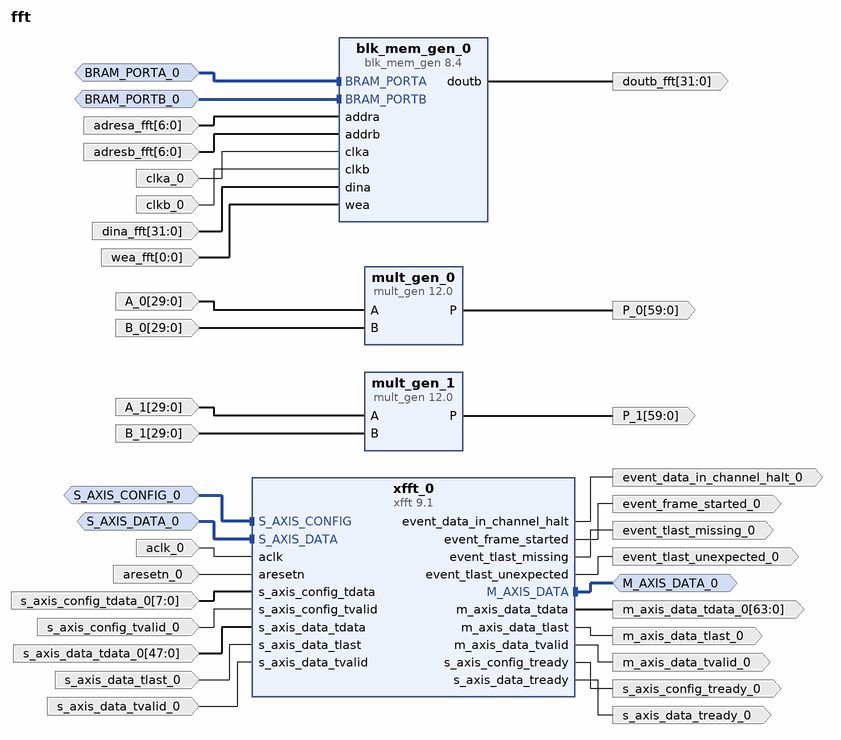
[diagram p0: block diagram of the top level]
# Vivado block design fft, xc7a35tcpg236-1, Vivado 2022.1
create_bd_design fft

create_bd_intf_port -mode Slave -vlnv xilinx.com:interface:axis_rtl:1.0 S_AXIS_DATA_0
set_property -dict [list \
  CONFIG.FREQ_HZ 40000000 \
  CONFIG.HAS_TKEEP 0 \
  CONFIG.HAS_TLAST 1 \
  CONFIG.HAS_TREADY 1 \
  CONFIG.HAS_TSTRB 0 \
  CONFIG.LAYERED_METADATA undef \
  CONFIG.TDATA_NUM_BYTES 6 \
  CONFIG.TDEST_WIDTH 0 \
  CONFIG.TID_WIDTH 0 \
  CONFIG.TUSER_WIDTH 0 \
] [get_bd_intf_ports S_AXIS_DATA_0]
create_bd_intf_port -mode Master -vlnv xilinx.com:interface:axis_rtl:1.0 M_AXIS_DATA_0
set_property -dict {CONFIG.FREQ_HZ 40000000} [get_bd_intf_ports M_AXIS_DATA_0]
create_bd_intf_port -mode Slave -vlnv xilinx.com:interface:axis_rtl:1.0 S_AXIS_CONFIG_0
set_property -dict [list \
  CONFIG.FREQ_HZ 40000000 \
  CONFIG.HAS_TKEEP 0 \
  CONFIG.HAS_TLAST 0 \
  CONFIG.HAS_TREADY 1 \
  CONFIG.HAS_TSTRB 0 \
  CONFIG.LAYERED_METADATA undef \
  CONFIG.TDATA_NUM_BYTES 1 \
  CONFIG.TDEST_WIDTH 0 \
  CONFIG.TID_WIDTH 0 \
  CONFIG.TUSER_WIDTH 0 \
] [get_bd_intf_ports S_AXIS_CONFIG_0]
create_bd_intf_port -mode Slave -vlnv xilinx.com:interface:bram_rtl:1.0 BRAM_PORTA_0
create_bd_intf_port -mode Slave -vlnv xilinx.com:interface:bram_rtl:1.0 BRAM_PORTB_0
create_bd_port -dir I -type clk aclk_0
set_property -dict {CONFIG.FREQ_HZ 40000000} [get_bd_ports aclk_0]
create_bd_port -dir I -type rst aresetn_0
create_bd_port -dir O -type intr event_data_in_channel_halt_0
create_bd_port -dir O -type intr event_frame_started_0
create_bd_port -dir O -type intr event_tlast_missing_0
create_bd_port -dir O -type intr event_tlast_unexpected_0
create_bd_port -dir O -from 63 -to 0 m_axis_data_tdata_0
create_bd_port -dir O m_axis_data_tlast_0
create_bd_port -dir O m_axis_data_tvalid_0
create_bd_port -dir I -from 47 -to 0 s_axis_data_tdata_0
create_bd_port -dir I s_axis_data_tlast_0
create_bd_port -dir O s_axis_data_tready_0
create_bd_port -dir I s_axis_data_tvalid_0
create_bd_port -dir I -from 7 -to 0 s_axis_config_tdata_0
create_bd_port -dir O s_axis_config_tready_0
create_bd_port -dir I s_axis_config_tvalid_0
create_bd_port -dir I -from 29 -to 0 -type data A_0
create_bd_port -dir I -from 29 -to 0 -type data B_0
create_bd_port -dir O -from 59 -to 0 -type data P_0
create_bd_port -dir I -from 29 -to 0 -type data A_1
create_bd_port -dir I -from 29 -to 0 -type data B_1
create_bd_port -dir O -from 59 -to 0 -type data P_1
create_bd_port -dir I -type clk clka_0
create_bd_port -dir I -from 31 -to 0 dina_fft
create_bd_port -dir I -from 0 -to 0 wea_fft
create_bd_port -dir I -type clk clkb_0
create_bd_port -dir O -from 31 -to 0 doutb_fft
create_bd_port -dir I -from 6 -to 0 adresa_fft
create_bd_port -dir I -from 6 -to 0 adresb_fft

create_bd_cell -type ip -vlnv xilinx.com:ip:xfft:9.1 xfft_0
set_property -dict [list \
  CONFIG.aresetn true \
  CONFIG.implementation_options radix_2_lite_burst_io \
  CONFIG.input_width 20 \
  CONFIG.number_of_stages_using_block_ram_for_data_and_phase_factors 0 \
  CONFIG.output_ordering natural_order \
  CONFIG.scaling_options unscaled \
  CONFIG.target_clock_frequency 100 \
  CONFIG.throttle_scheme realtime \
  CONFIG.transform_length 512 \
] [get_bd_cells xfft_0]
create_bd_cell -type ip -vlnv xilinx.com:ip:mult_gen:12.0 mult_gen_0
set_property -dict [list \
  CONFIG.Multiplier_Construction Use_Mults \
  CONFIG.PipeStages 0 \
  CONFIG.PortAType Signed \
  CONFIG.PortAWidth 30 \
  CONFIG.PortBWidth 30 \
] [get_bd_cells mult_gen_0]
create_bd_cell -type ip -vlnv xilinx.com:ip:mult_gen:12.0 mult_gen_1
set_property -dict [list \
  CONFIG.Multiplier_Construction Use_Mults \
  CONFIG.PipeStages 0 \
  CONFIG.PortAWidth 30 \
  CONFIG.PortBWidth 30 \
] [get_bd_cells mult_gen_1]
create_bd_cell -type ip -vlnv xilinx.com:ip:blk_mem_gen:8.4 blk_mem_gen_0
set_property -dict [list \
  CONFIG.Enable_32bit_Address false \
  CONFIG.Enable_A Always_Enabled \
  CONFIG.Enable_B Always_Enabled \
  CONFIG.Memory_Type Simple_Dual_Port_RAM \
  CONFIG.Operating_Mode_A NO_CHANGE \
  CONFIG.Port_B_Clock 100 \
  CONFIG.Port_B_Enable_Rate 100 \
  CONFIG.Register_PortB_Output_of_Memory_Primitives true \
  CONFIG.Use_Byte_Write_Enable false \
  CONFIG.Write_Depth_A 128 \
  CONFIG.use_bram_block Stand_Alone \
] [get_bd_cells blk_mem_gen_0]

# ---- connections ----

connect_bd_intf_net -intf_net BRAM_PORTA_0_1 [get_bd_intf_ports BRAM_PORTA_0] [get_bd_intf_pins blk_mem_gen_0/BRAM_PORTA]
connect_bd_intf_net -intf_net BRAM_PORTB_0_1 [get_bd_intf_ports BRAM_PORTB_0] [get_bd_intf_pins blk_mem_gen_0/BRAM_PORTB]
connect_bd_intf_net -intf_net S_AXIS_CONFIG_0_1 [get_bd_intf_ports S_AXIS_CONFIG_0] [get_bd_intf_pins xfft_0/S_AXIS_CONFIG]
connect_bd_intf_net -intf_net S_AXIS_DATA_0_1 [get_bd_intf_ports S_AXIS_DATA_0] [get_bd_intf_pins xfft_0/S_AXIS_DATA]
connect_bd_intf_net [get_bd_intf_ports M_AXIS_DATA_0] [get_bd_intf_pins xfft_0/M_AXIS_DATA]
connect_bd_net -net A_0_1 [get_bd_ports A_0] [get_bd_pins mult_gen_0/A]
connect_bd_net -net A_1_1 [get_bd_ports A_1] [get_bd_pins mult_gen_1/A]
connect_bd_net -net B_0_1 [get_bd_ports B_0] [get_bd_pins mult_gen_0/B]
connect_bd_net -net B_1_1 [get_bd_ports B_1] [get_bd_pins mult_gen_1/B]
connect_bd_net -net aclk_0_1 [get_bd_ports aclk_0] [get_bd_pins xfft_0/aclk]
connect_bd_net -net addra_0_1 [get_bd_ports adresa_fft] [get_bd_pins blk_mem_gen_0/addra]
connect_bd_net -net addrb_0_1 [get_bd_ports adresb_fft] [get_bd_pins blk_mem_gen_0/addrb]
connect_bd_net -net aresetn_0_1 [get_bd_ports aresetn_0] [get_bd_pins xfft_0/aresetn]
connect_bd_net [get_bd_pins blk_mem_gen_0/doutb] [get_bd_ports doutb_fft]
connect_bd_net -net clka_0_1 [get_bd_ports clka_0] [get_bd_pins blk_mem_gen_0/clka]
connect_bd_net -net clkb_0_1 [get_bd_ports clkb_0] [get_bd_pins blk_mem_gen_0/clkb]
connect_bd_net [get_bd_ports dina_fft] [get_bd_pins blk_mem_gen_0/dina]
connect_bd_net [get_bd_pins mult_gen_0/P] [get_bd_ports P_0]
connect_bd_net [get_bd_pins mult_gen_1/P] [get_bd_ports P_1]
connect_bd_net -net s_axis_config_tdata_0_1 [get_bd_ports s_axis_config_tdata_0] [get_bd_pins xfft_0/s_axis_config_tdata]
connect_bd_net -net s_axis_config_tvalid_0_1 [get_bd_ports s_axis_config_tvalid_0] [get_bd_pins xfft_0/s_axis_config_tvalid]
connect_bd_net -net s_axis_data_tdata_0_1 [get_bd_ports s_axis_data_tdata_0] [get_bd_pins xfft_0/s_axis_data_tdata]
connect_bd_net -net s_axis_data_tlast_0_1 [get_bd_ports s_axis_data_tlast_0] [get_bd_pins xfft_0/s_axis_data_tlast]
connect_bd_net -net s_axis_data_tvalid_0_1 [get_bd_ports s_axis_data_tvalid_0] [get_bd_pins xfft_0/s_axis_data_tvalid]
connect_bd_net -net wea_0_1 [get_bd_ports wea_fft] [get_bd_pins blk_mem_gen_0/wea]
connect_bd_net [get_bd_pins xfft_0/event_data_in_channel_halt] [get_bd_ports event_data_in_channel_halt_0]
connect_bd_net [get_bd_pins xfft_0/event_frame_started] [get_bd_ports event_frame_started_0]
connect_bd_net [get_bd_pins xfft_0/event_tlast_missing] [get_bd_ports event_tlast_missing_0]
connect_bd_net [get_bd_pins xfft_0/event_tlast_unexpected] [get_bd_ports event_tlast_unexpected_0]
connect_bd_net [get_bd_pins xfft_0/m_axis_data_tdata] [get_bd_ports m_axis_data_tdata_0]
connect_bd_net [get_bd_pins xfft_0/m_axis_data_tlast] [get_bd_ports m_axis_data_tlast_0]
connect_bd_net [get_bd_pins xfft_0/m_axis_data_tvalid] [get_bd_ports m_axis_data_tvalid_0]
connect_bd_net [get_bd_pins xfft_0/s_axis_config_tready] [get_bd_ports s_axis_config_tready_0]
connect_bd_net [get_bd_pins xfft_0/s_axis_data_tready] [get_bd_ports s_axis_data_tready_0]

validate_bd_design
save_bd_design
